# Altium project PCB_Project1.PrjPCB
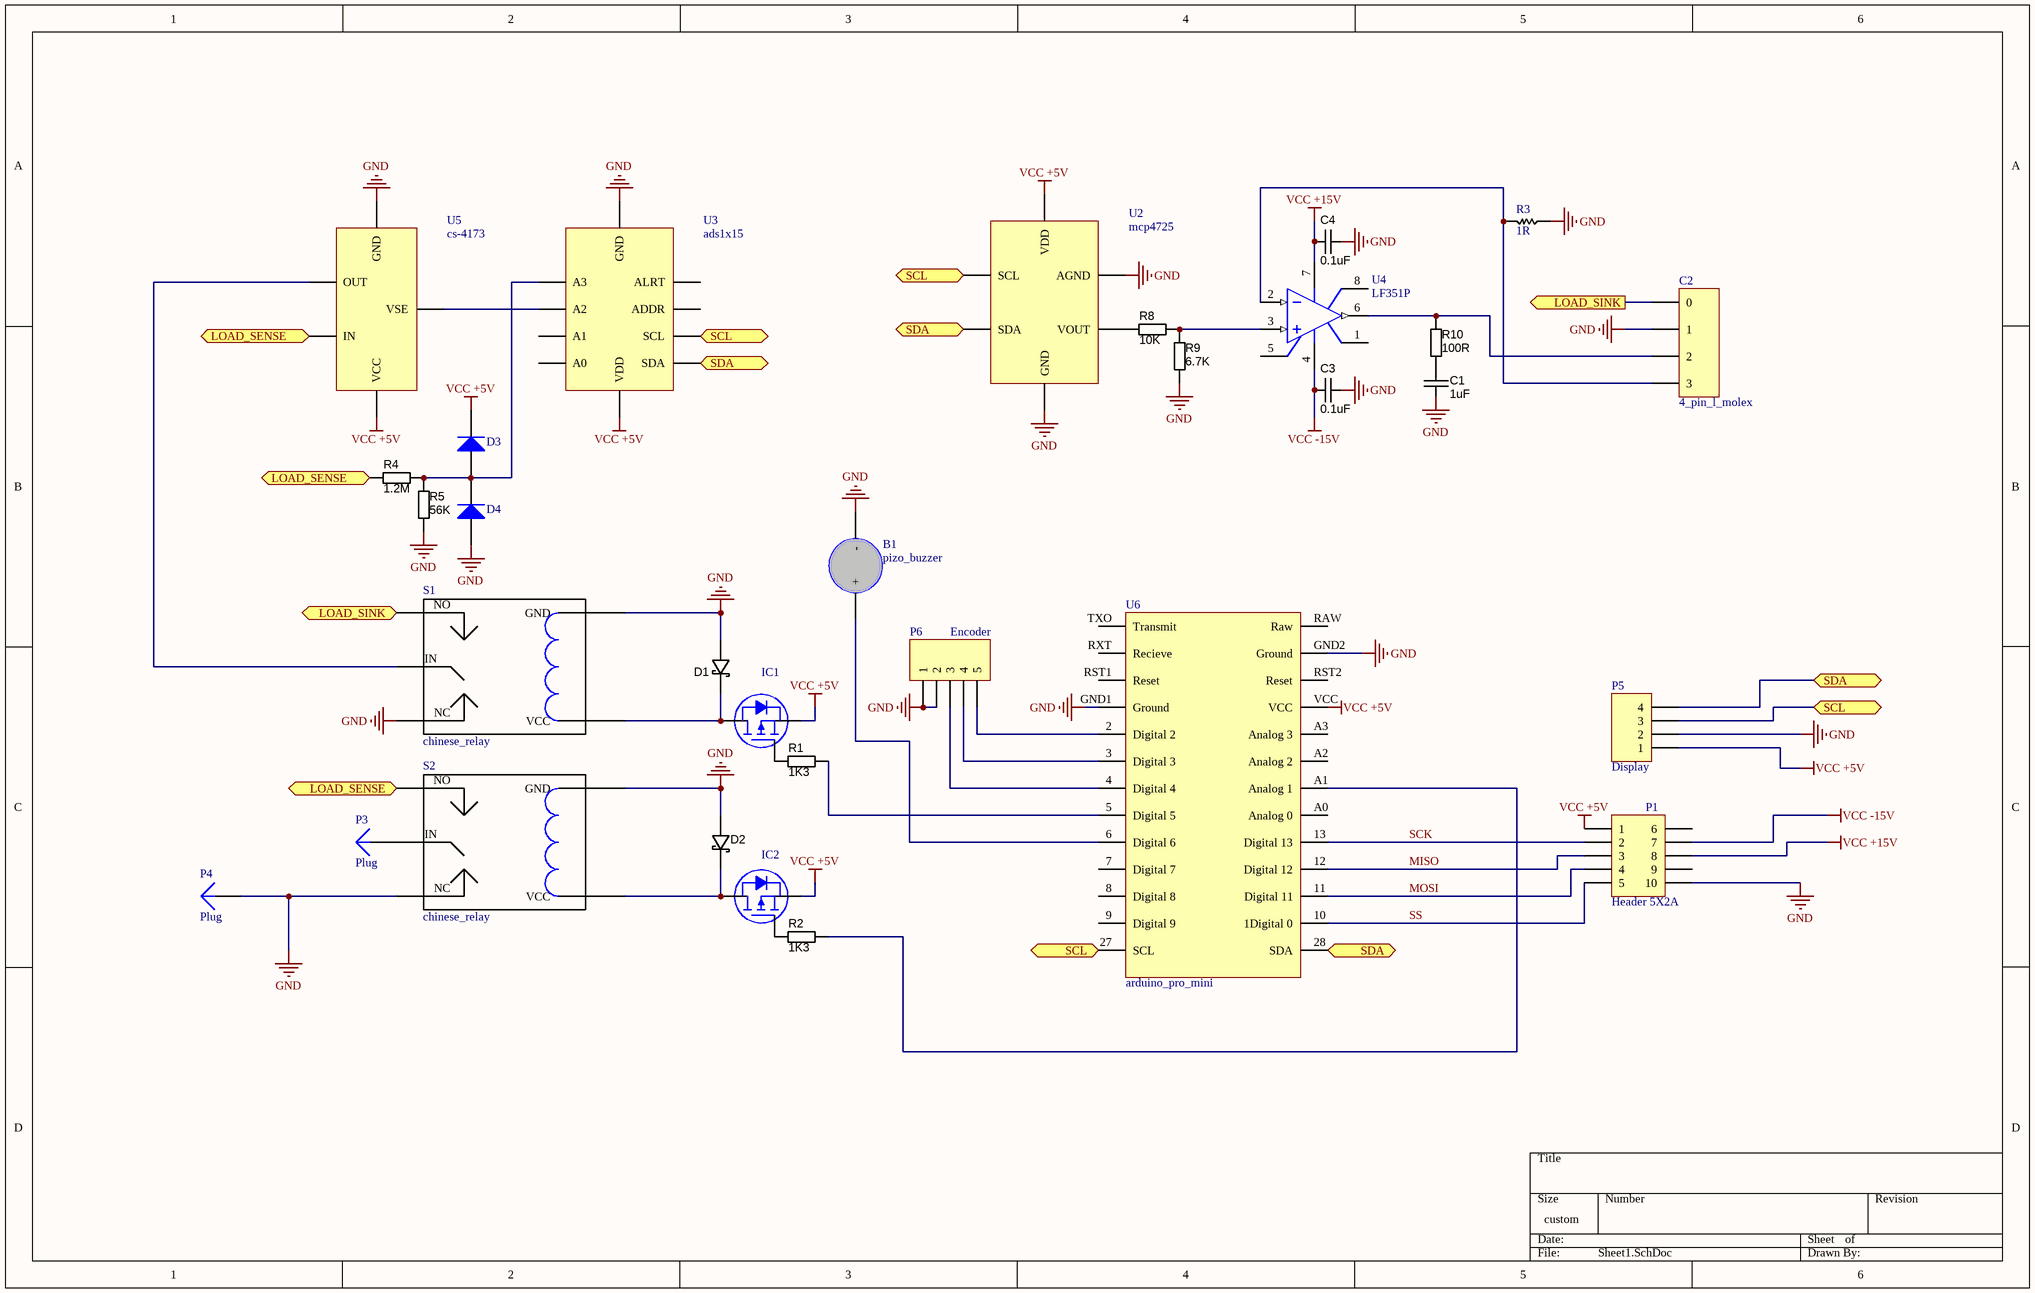
[diagram p0: Sheet1.SchDoc]
1 sheet, 31 parts. Net scope: flat (ports and power ports of the same name join across sheets).
Board file: PCB1.PcbDoc

## Sheet Sheet1.SchDoc
size 381 x 241 mm

### Parts
B1  pizo_buzzer  [pizo_buzzer]
C1  value 1uF  [CAPC2012X135N]  (hidden comment: approved sub OK)
C2  4_pin_l_molex  [4_pin_l_molex]
C3  value 0.1uF  [CAPC2012X135N]  (hidden comment: approved sub OK)
C4  value 0.1uF  [CAPC2012X135N]  (hidden comment: approved sub OK)
D1  DIODE_SCHOTTKY_40V_1A  [SOD123]  (value not drawn)
D2  DIODE_SCHOTTKY_40V_1A  [SOD123]  (value not drawn)
D3  Diode 1N4001  [DO-41]  (value not drawn)
D4  Diode 1N4001  [DO-41]  (value not drawn)
IC1  IRLML6402TRPBF  [INFINEON SOT-23-3]  (value not drawn)
IC2  IRLML6402TRPBF  [INFINEON SOT-23-3]  (value not drawn)
P1  Header 5X2A  [HDR2X5_CEN]
P3  Plug  [PIN1]
P4  Plug  [PIN1]
P5  Display  [HDR1X4]
P6  Encoder  [HDR1X5]
R1  value 1K3  [RESC2012X70N]  (hidden comment: Thick Film)
R2  value 1K3  [RESC2012X70N]  (hidden comment: Thick Film)
R3  1R  [100w_1ohm_power_resistor]
R4  value 1.2M  [RESC2012X70N]  (hidden comment: Thick Film)
R5  value 56K  [RESC2012X70N]  (hidden comment: Thick Film)
R8  value 10K  [RESC2012X70N]  (hidden comment: Thick Film)
R9  value 6.7K  [RESC2012X70N]  (hidden comment: Thick Film)
R10  value 100R  [RESC2012X70N]  (hidden comment: Thick Film)
S1  chinese_relay  [chinese_relay]
S2  chinese_relay  [chinese_relay]
U2  mcp4725  [mcp4725]
U3  ads1x15  [ads1x15]
U4  LF351P  [P008]
U5  cs-4173  [cs-4173]
U6  arduino_pro_mini  [arduino_pro_mini]

### Ports
LOAD_SENSE (in), LOAD_SENSE (out), LOAD_SINK (in), LOAD_SINK (out), SCL, SCL (bidir), SDA, SDA (bidir)

### Nets
GND: B1.0(-) C1.2 C2.1 C3.2 C4.2 D1.A D2.A D4.1(A) P1.10 P4.1 P5.2 P6.1 P6.2 R3.1 R5.1 R9.1 S1.GND S1.NC S2.GND S2.NC U2.AGND U2.GND U3.GND U5.GND U6.GND1(Ground) U6.GND2(Ground)
VCC +5V: D3.2(K) IC1.3(S) IC2.3(S) P1.1 P5.1 U2.VDD U3.VDD U5.VCC U6.VCC
VCC +15V: C4.1 P1.8 U4.7(V+)
VCC -15V: C3.1 P1.7 U4.4(V-)
MISO: P1.3 U6.12(Digital_12)
MOSI: P1.4 U6.11(Digital_11)
SCK: P1.2 U6.13(Digital_13)
SS: P1.5 U6.10(1Digital_0)
NetB1_1: B1.1(+) U6.6(Digital_6)
NetC1_1: C1.1 R10.1
NetC2_0: C2.0 S1.NO ; port LOAD_SINK
NetC2_2: C2.2 R10.2 U4.6(OUT)
NetC2_3: C2.3 R3.2 U4.2(IN-)
NetD1_K: D1.K IC1.2(D) S1.VCC
NetD2_K: D2.K IC2.2(D) S2.VCC
NetD3_1: D3.1(A) D4.2(K) R4.2 R5.2 U3.A3
NetIC1_1: IC1.1(G) R1.1
NetIC2_1: IC2.1(G) R2.1
NetP3_1: P3.1 S2.IN
NetP5_3: P5.3 U2.SCL U3.SCL U6.27(SCL) ; port SCL
NetP5_4: P5.4 U2.SDA U3.SDA U6.28(SDA) ; port SDA
NetP6_3: P6.3 U6.4(Digital_4)
NetP6_4: P6.4 U6.3(Digital_3)
NetP6_5: P6.5 U6.2(Digital_2)
NetR1_2: R1.2 U6.5(Digital_5)
NetR2_2: R2.2 U6.A1(Analog_1)
NetR4_1: R4.1 S2.NO U5.IN ; port LOAD_SENSE
NetR8_1: R8.1 U2.VOUT
NetR8_2: R8.2 R9.2 U4.3(IN+)
NetS1_IN: S1.IN U5.OUT
NetU3_A2: U3.A2 U5.VSE

Not connected (* = marked no-connect by the designer): P1 6 9; U3 A0 A1 ADDR ALRT; U4 1(OS_TRIM) 5(OS_TRIM) 8(NC); U6 7(Digital_7) 8(Digital_8) 9(Digital_9) A0(Analog_0) A2(Analog_2) A3(Analog_3) RAW(Raw) RST1(Reset) RST2(Reset) RXT(Recieve) TXO(Transmit)

### Library data of the parts
C1 C3 C4 = CAPC_1n8_50V_0805: Capacitor SMD Cer 1.8nF 10% 50V X7R 0805; Manufacturer 1: AVX Corporation; Manufacturer Part Number 1: 08055C182KAT2A; Ratings: 50V; X7R; SCDType: source*; Tolerance: ±10%; Operating Temperature: -55°C ~ 125°C; Package / Case: 0805 (2012 metric); Supplier 1: Digi-Key; Supplier Part Number 1: 478-1374-1-ND
D1 D2 = DIODE_SCHOTTKY_40V_1A: Diode Schottky SMD 40V 1A SOD123; Manufacturer 1: Diodes Inc; Manufacturer Part Number 1: 1N5819HW-7-F; Ratings: 40V; 1A; Material: Si; SCDType: spec; Package / Case: SOD123; Diode Type: Schottky; Mounting Type: Surface Mount; Supplier 1: Digi-Key; Supplier Part Number 1: 1N5819HW-FDICT-ND
D3 D4 = Diode 1N4001: 1 Amp General Purpose Rectifier; Published: 8-Jun-2000; LatestRevisionDate: 17-Jul-2002; LatestRevisionNote: Re-released for DXP Platform.; DatasheetVersion: 1998; PackageVersion: Aug-1999; PackageReference: DO-41; Publisher: Altium Limited; PackageDescription: Diode, Axial; Body 5.2 x 2.7 mm (LxDia. max), Lead Dia. 0.86 mm (max); Code_JEDEC: DO-204-AL; ComponentLink1Description: Manufacturer Link; ComponentLink1URL: http://www.fairchildsemi.com/; ComponentLink2Description: Datasheet; ComponentLink2URL: http://www.fairchildsemi.com/ds/1N%2F1N4001.pdf
IC1 IC2 = IRLML6402TRPBF: MOSFET P-CH 20V 3.7A SOT-23; Manufacturer: Infineon Technologies Americas Corp.; Rds On (Max) at Id, Vgs: 65 mOhm @ 3.7A, 4.5V; Vgs(th) (Max) at Id: 1.2V @ 250uA; Gate Charge (Qg): 12nC @ 5V; Input Capacitance (Ciss) at Vds: 633pF @ 10V; Power - Max: 1.3W; Current Continuous Drain: 3.7A (Ta); Part Number: IRLML6402TRPBF; PartId: 8159; Supplier 1: Digi-Key; Supplier Part Number 1: IRLML6402PBFTR-ND; ComponentLink1Description: Datasheet; ComponentLink1URL: http://www.irf.com/product-info/datasheets/data/irlml6402pbf.pdf; ComponentLink2Description: Digi-Key Listing; ComponentLink2URL: http://www.digikey.com/product-detail/en/IRLML6402TRPBF/IRLML6402PBFTR-ND/811437; Price: 0.0864; Type: MOSFET P-Channel, Metal Oxide; Device Package: TO-236-3, SC-59, SOT-23-3; Drain to Source Voltage (Vdss): 20V; Features: Standard
P1 = Header 5X2A: Header, 5-Pin, Dual row; LatestRevisionDate: 17-Jul-2002; LatestRevisionNote: Re-released for DXP Platform.; Publisher: Altium Limited
P5 = Header 4: Header, 4-Pin; LatestRevisionDate: 17-Jul-2002; LatestRevisionNote: Re-released for DXP Platform.; Publisher: Altium Limited
P6 = Header 5: Header, 5-Pin; LatestRevisionDate: 17-Jul-2002; LatestRevisionNote: Re-released for DXP Platform.; Publisher: Altium Limited
R1 R2 R4 R5 R8-R10 = RES_1K3_0805_1%: Resistor SMD chip 1.3k Ohm 0.125W 1% 0805; Manufacturer 1: Vishay/Dale; Manufacturer Part Number 1: CRCW08051K30FKEA; Ratings: 1/8W; SCDType: spec; Package / Case: 0805 (2012 metric); Supplier 1: Digi-Key; Supplier Part Number 1: 541-1.30KCCT-ND; Tolerance: ±1%
R3 = 1ohm_100w_power_resistor
U4 = LF351P: Operational Amplifier; Note: Pin 8 is not connected; ComponentAvailability: Obsolete; Published: 16-Jan-2001; LatestRevisionDate: 04-Mar-2005; LatestRevisionNote: Stylized 3D Model Added.; DatasheetVersion: Aug-1994; PackageVersion: Jun-1999; PackageReference: P008; Publisher: Altium Limited; PackageDescription: DIP; 8 Leads; Row Spacing 7.62 mm; Pitch 2.54 mm; Code_JEDEC: MO-001-AN; ComponentLink1Description: Manufacturer Link; ComponentLink1URL: http://www.ti.com/; ComponentLink2Description: Datasheet; ComponentLink2URL: http://www-s.ti.com/sc/ds/lf351.pdf
P3 P4 = Plug: LatestRevisionDate: 17-Jul-2002; LatestRevisionNote: Re-released for DXP Platform.; Publisher: Altium Limited